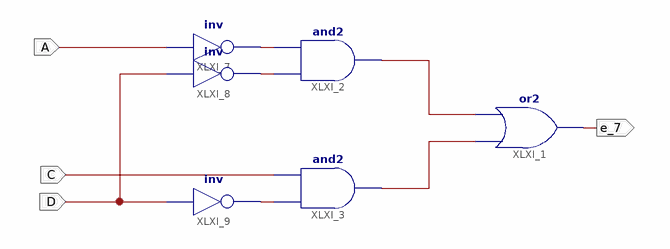
[diagram p0: schematic sheet 1]
// Xilinx ISE schematic bcd_for_e.sch (spartan6) as structural Verilog: 6 symbols, 4 ports
module bcd_for_e (
  input  C,
  input  D,
  input  A,
  output e_7
);

  wire XLXN_1, XLXN_2, XLXN_3, XLXN_5, XLXN_6;

  and XLXI_2 (XLXN_5, XLXN_2, XLXN_1);
  and XLXI_3 (XLXN_6, XLXN_3, C);
  or XLXI_1 (e_7, XLXN_6, XLXN_5);
  not XLXI_7 (XLXN_1, A);
  not XLXI_8 (XLXN_2, D);
  not XLXI_9 (XLXN_3, D);
endmodule
